# EasyEDA Pro project 轮足机器人主板&核心板.epro, schematic 377核心板原理图
Board Name: 377核心板; Create Date: 2025-02-25; Page Name: 377核心板PCB; Project Name: 轮足机器人主板&核心板; Schematic Name: 377核心板原理图; Update Date: 2025-03-06; Company: 海思路999号412所; Drawed: YienMaster; Page Size: A4; Version: V1.0
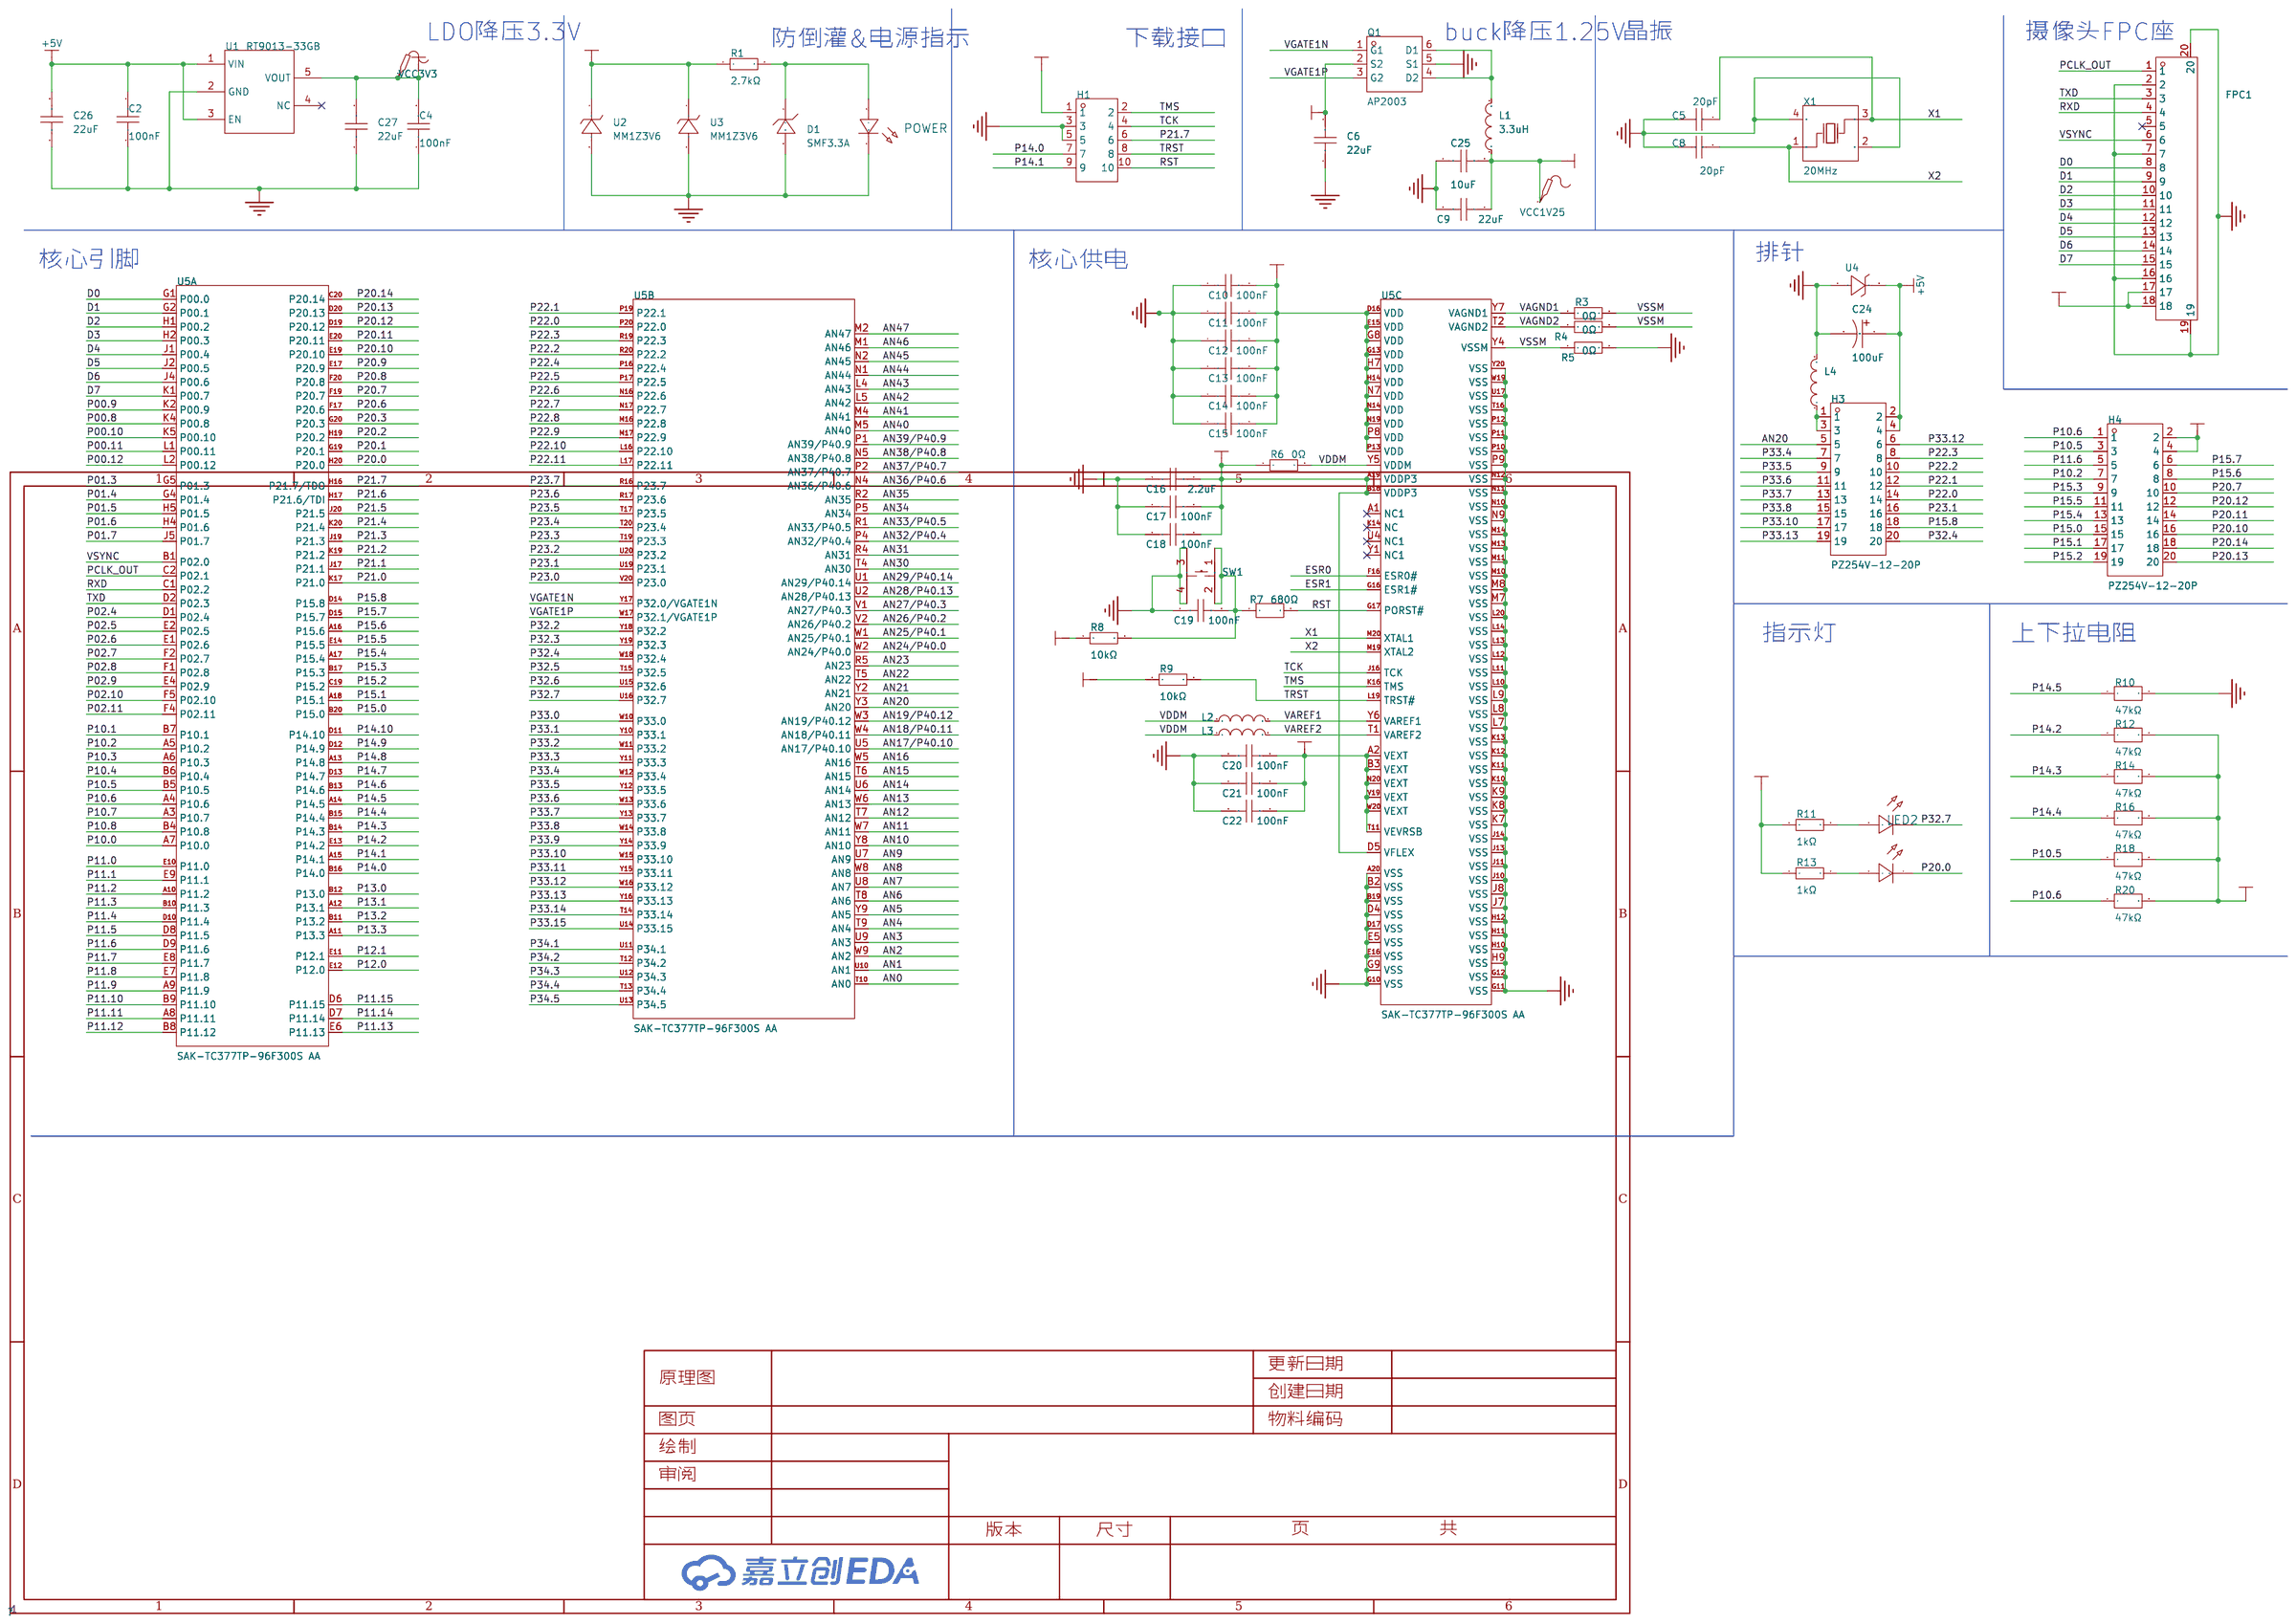
[diagram p5: schematic sheet]

## Parts
C2  100nF  [C0603]
C4  100nF  [C0603]
C5  20pF  [C0603]
C6  22uF  [C0603]
C8  20pF  [C0603]
C9  22uF  [C0603]
C10  100nF  [C0603]
C11  100nF  [C0603]
C12  100nF  [C0603]
C13  100nF  [C0603]
C14  100nF  [C0603]
C15  100nF  [C0603]
C16  2.2uF  [C0603]
C17  100nF  [C0603]
C18  100nF  [C0603]
C19  100nF  [C0603]
C20  100nF  [C0603]
C21  100nF  [C0603]
C22  100nF  [C0603]
C24  100uF  [CAP-SMD_L3.5-W2.8-R-RD]
C25  10uF  [C0603]
C26  22uF  [C0603]
C27  22uF  [C0603]
D1  SMF3.3A  [SOD-123_L2.8-W1.8-LS3.7-RD]
FPC1  FPC-05F-18PH20  [FPC-SMD_18P-P0.50_FPC-05F-18PH20]
H1  PZ254V-12-10P  [HDR-TH_10P-P2.54-V-M-R2-C5-S2.54]
H3  PZ254V-12-20P  [HDR-TH_20P-P2.54-V-M-R2-C10-S2.54]
H4  PZ254V-12-20P  [HDR-TH_20P-P2.54-V-M-R2-C10-S2.54]
L1  3.3uH  [IND-SMD_L4.4-W4.2-A]
L2  CBG160808U000T  [L0603]
L3  CBG160808U000T  [L0603]
L4  CBG201209U000T  [L0805]
LED2  -  [LED_0603]
LED3  -  [LED_0603]
POWER  -  [LED_0603]
Q1  AP2003  [SOT-23-6_L2.9-W1.6-P0.95-LS2.8-BR]
R1  2.7kΩ  [R0603]
R3  0Ω  [R0603]
R4  0Ω  [R0603]
R5  0Ω  [R0603]
R6  0Ω  [R0603]
R7  680Ω  [R0603]
R8  10kΩ  [R0603]
R9  10kΩ  [R0603]
R10  47kΩ  [R0603]
R11  1kΩ  [R0603]
R12  47kΩ  [R0603]
R13  1kΩ  [R0603]
R14  47kΩ  [R0603]
R16  47kΩ  [R0603]
R18  47kΩ  [R0603]
R20  47kΩ  [R0603]
SW1  TS3425BA  [SW-SMD_4P-L4.2-W3.2-P2.15-LS4.6-1]
U1  RT9013-33GB  [SOT-23-5_L3.0-W1.7-P0.95-LS2.8-BL]
U2  MM1Z3V6  [SOD-123_L2.7-W1.6-LS3.7-RD]
U3  MM1Z3V6  [SOD-123_L2.7-W1.6-LS3.7-RD]
U4  MM1Z5V1  [SOD-123_L2.8-W1.8-LS3.9-FD]
U5  SAK-TC377TP-96F300S AA  [PG-LFBGA-292_L17.0-W17.0-BL_SAK-TC1791F]  (sections 1,2,3)
VCC1V25  -  [Test-Point-0.5mm]
VCC3V3  -  [Test-Point-0.5mm]
X1  20MHz  [CRYSTAL-SMD_4P-L3.2-W2.5-BL-2]

## Library data of the parts
C2 C4 = CC0603KRX7R9BB104: 容值:100nF;精度:±10%;额定电压:50V;材质(温度系数):X7R;; LCSC Part Name: 100nF ±10% 50V; Supplier Part: C14663; Manufacturer: YAGEO(国巨); Supplier Footprint: 0603; JLCPCB Part Class: 基础库; Datasheet: https://atta.szlcsc.com/upload/public/pdf/source/20180910/C282072_33301C7F631E79921B82A8DAC6BCC5B3.pdf; Supplier: LCSC; Tolerance: ±10%; Voltage Rated: 50V; Temperature Coefficient: X7R
C5 C8 = CL10C200JB8NNNC: 容值:20pF;精度:±5%;额定电压:50V;材质(温度系数):C0G;; LCSC Part Name: 20pF ±5% 50V; Supplier Part: C1648; Manufacturer: SAMSUNG(三星); Supplier Footprint: 0603; JLCPCB Part Class: 基础库; Datasheet: https://atta.szlcsc.com/upload/public/pdf/source/20160218/1457707763339.pdf; Supplier: LCSC; Tolerance: ±5%; Voltage Rated: 50V; Temperature Coefficient: C0G
C6 C9 C26 C27 = CGA0603X5R226M160JT: 容值:22uF;精度:±20%;额定电压:16V;材质(温度系数):X5R;; LCSC Part Name: 22uF ±20% 16V; Supplier Part: C6119868; Manufacturer: HRE(芯声); Supplier Footprint: 0603; JLCPCB Part Class: 扩展库; Supplier: LCSC; Tolerance: ±20%; Voltage Rated: 16V; Temperature Coefficient: X5R
C10-C15 = CGA0603X7R104K500JT: 容值:100nF;精度:±10%;额定电压:50V;材质(温度系数):X7R;; LCSC Part Name: 100nF ±10% 50V; Supplier Part: C6119867; Manufacturer: HRE(芯声); Supplier Footprint: 0603; JLCPCB Part Class: 扩展库; Supplier: LCSC; Tolerance: ±10%; Voltage Rated: 50V; Temperature Coefficient: X7R
C16 = CL10A225KB8NNNC: 容值:2.2uF;精度:±10%;额定电压:50V;材质(温度系数):X5R;; LCSC Part Name: 2.2uF ±10% 50V; Supplier Part: C913904; Manufacturer: SAMSUNG(三星); Supplier Footprint: 0603; JLCPCB Part Class: 扩展库; Datasheet: https://atta.szlcsc.com/upload/public/pdf/source/20160218/1457707763339.pdf; Supplier: LCSC; Tolerance: ±10%; Voltage Rated: 50V; Temperature Coefficient: X5R
C17-C22 = CAP_0603: Supplier Footprint: 0603
C24 = CA45-B-6.3V-100uF-M: 容值:100uF;精度:±20%;额定电压:6.3V;等效串联电阻:5Ω@100kHz;; LCSC Part Name: 100uF ±20% 6.3V; Supplier Part: C140373; Manufacturer: CEC(振华新云); Supplier Footprint: CASE-B-3528; JLCPCB Part Class: 扩展库; Datasheet: https://atta.szlcsc.com/upload/public/pdf/source/20180125/C140373_15168614962001301521.pdf; Supplier: LCSC; Tolerance: ±20%; Rated Voltage: 6.3V; Equivalent Series Resistance(ESR): 5Ω@100kHz; Operating Temperature: -55℃~+125℃
C25 = CGA0603X5R106K100JT: 容值:10uF;精度:±10%;额定电压:10V;材质(温度系数):X5R;; LCSC Part Name: 10uF ±10% 10V; Supplier Part: C6119842; Manufacturer: HRE(芯声); Supplier Footprint: 0603; JLCPCB Part Class: 扩展库; Supplier: LCSC; Tolerance: ±10%; Voltage Rated: 10V; Temperature Coefficient: X5R
D1 = SMF3.3A_C37331473: 极性:单向;反向截止电压(Vrwm):3.3V;最大钳位电压:7.3V;峰值脉冲电流(Ipp):27.4A;峰值脉冲功率(Ppp):200W;击穿电压:4.3V;; Supplier Part: C37331473; Manufacturer: GOODWORK(固得沃克); Supplier Footprint: SOD-123FL; Datasheet: https://atta.szlcsc.com/upload/public/pdf/source/20240801/D4B373D0611F6B4675800B8155207CFE.pdf; Supplier: LCSC; polarity: 单向; Reverse Stand-Off Voltage (Vrwm): 3.3V; Maximum Clamping Voltage: 7.3V; Peak Pulse Current (Ipp): 27.4A; Peak Pulse Power Dissipation (Ppp): 200W; Breakdown Voltage: 4.3V; Reverse Leakage Current (Ir): 80nA; Number of Lines: 单路; Operating Temperature: -55℃~+150℃@(Tj); Type: TVS
FPC1 = FPC-05F-18PH20: 锁定特性:翻盖式;触点类型:下接;触点数量:18P;间距:0.5mm;安装类型:卧贴;工作温度范围:-25℃~+85℃;; LCSC Part Name: 间距:0.5mm P数:18P 翻盖式 下接; Supplier Part: C2856802; Manufacturer: XUNPU(讯普); Supplier Footprint: SMD,P=0.5mm,卧贴; JLCPCB Part Class: 扩展库; Datasheet: https://atta.szlcsc.com/upload/public/pdf/source/20210922/C2856802_2A845D1961F33AEC1ED22CECB292335F.pdf; Supplier: LCSC; Locking Feature: 翻盖式; Contact Type: 下接; Number of Contacts: 18P; Pitch: 0.5mm; Mounting Type: 卧贴; FFC, FCB Thickness: 0.3mm; Height Above Board: 2mm; Operating Temperature Range: -25℃~+85℃
H1 = PZ254V-12-10P: 插针结构:2x5P;间距:2.54mm;行距:2.54mm;圆针/方针:方针;安装类型:直插;排数:双排;总PIN位数:10P;额定电流:-;额定电压:-;配合针长度:6mm;塑高:2.5mm;端接针长度:3mm;触头材质:黄铜;触头镀层:-;工作温度范围:-40℃~+105℃;颜色:黑色;; LCSC Part Name: 间距:2.54mm 2x5P 直插 方针; Supplier Part: C492422; Manufacturer: XFCN(兴飞); Supplier Footprint: 插件,P=2.54mm; JLCPCB Part Class: 扩展库; Datasheet: https://atta.szlcsc.com/upload/public/pdf/source/20200309/C492422_5020CEA01BE7051F9EA9DD81AB0A25E3.pdf; Supplier: LCSC; Pin Structure: 2x5P; Pitch: 2.54mm; Row Spacing: 2.54mm; Circluar Pins/Square Pins: 方针; Mounting Type: 直插; Number of Rows: 双排; Number of Pins: 10P; Length of Mating Pin: 6mm; Insulation Height: 2.5mm; Length of End Connection Pin: 3mm; Contact Material: 黄铜; Operating Temperature Range: -40℃~+105℃; Color: 黑色
H3 H4 = PZ254V-12-20P: 插针结构:2x10P;间距:2.54mm;行距:2.54mm;圆针/方针:方针;安装类型:直插;排数:双排;总PIN位数:20P;额定电流:-;额定电压:-;配合针长度:6mm;塑高:2.5mm;端接针长度:3mm;触头材质:黄铜;触头镀层:-;工作温度范围:-40℃~+105℃;颜色:黑色;; LCSC Part Name: 间距:2.54mm 2x10P 直插 方针; Supplier Part: C492427; Manufacturer: XFCN(兴飞); Supplier Footprint: 插件,P=2.54mm; JLCPCB Part Class: 扩展库; Datasheet: https://atta.szlcsc.com/upload/public/pdf/source/20200309/C492427_9411E93D35F2EC20CED9A3ED9F4BBE60.pdf; Supplier: LCSC; Pin Structure: 2x10P; Pitch: 2.54mm; Row Spacing: 2.54mm; Circluar Pins/Square Pins: 方针; Mounting Type: 直插; Number of Rows: 双排; Number of Pins: 20P; Length of Mating Pin: 6mm; Insulation Height: 2.5mm; Length of End Connection Pin: 3mm; Contact Material: 黄铜; Operating Temperature Range: -40℃~+105℃; Color: 黑色
L1 = FXL0420-3R3-M: 电感值:3.3uH;精度:±20%;额定电流:3.3A;饱和电流(Isat):4A;类型:一体成型电感;; LCSC Part Name: 3.3uH ±20% 4A; Supplier Part: C167207; Manufacturer: cjiang(长江微电); Supplier Footprint: SMD,4.2x4.4mm; JLCPCB Part Class: 扩展库; Datasheet: https://atta.szlcsc.com/upload/public/pdf/source/20240426/3189EA8206330E2108542F9E34E540E7.pdf; Supplier: LCSC; Tolerance: ±20%; Rated Current: 3.3A; Saturation Current (Isat): 4A; DC Resistance (DCR): 87mΩ; Type: 一体成型电感
L2 L3 = CBG160808U000T: 标称阻抗@测试频率:0Ω@100MHz;直流电阻(RDC):100mΩ;; LCSC Part Name: 单路 0603磁珠 阻抗0Ω@100MHz; Supplier Part: C43163; Manufacturer: FH(风华); Supplier Footprint: 0603; JLCPCB Part Class: 扩展库; Datasheet: https://atta.szlcsc.com/upload/public/pdf/source/20190129/C361667_1614D407CC98D1D3CFBD9E1F7511C14D.pdf; Supplier: LCSC; Impedance @ Frequency: 0Ω@100MHz; DC Resistance: 100mΩ; Current Rating: 800mA; Circuits: 1
L4 = CBG201209U000T: 标称阻抗@测试频率:0Ω@100MHz;直流电阻(RDC):80mΩ;; LCSC Part Name: 单路 0805磁珠 阻抗0Ω@100MHz; Supplier Part: C91037; Manufacturer: FH(风华); Supplier Footprint: 0805; JLCPCB Part Class: 扩展库; Datasheet: https://atta.szlcsc.com/upload/public/pdf/source/20161217/1481939213023.pdf; Supplier: LCSC; Impedance @ Frequency: 0Ω@100MHz; DC Resistance: 80mΩ; Current Rating: 900mA; Circuits: 1
LED2 LED3 POWER = LED_0603-R: Supplier Footprint: 0603
Q1 = AP2003: 类型:1个N沟道+1个P沟道;漏源电压(Vdss):20V;连续漏极电流(Id):3A;导通电阻(RDS(on)@Vgs,Id):75mΩ@4.5V,2.5A;功率(Pd):800mW;阈值电压(Vgs(th)@Id):700mV@250uA;; LCSC Part Name: 1个N沟道+1个P沟道 耐压:20V 电流:3A; Supplier Part: C2849575; Manufacturer: ALLPOWER(铨力); Supplier Footprint: SOT-23-6; JLCPCB Part Class: 扩展库; Datasheet: https://atta.szlcsc.com/upload/public/pdf/source/20210723/C2849575_D5662A091ADF76BB7231C05490DE9B38.pdf; Supplier: LCSC; Type: 1个N沟道+1个P沟道; Drain Source Voltage (Vdss): 20V; Continuous Drain Current (Id): 3A; Drain Source On Resistance (RDS(on)@Vgs,Id): 75mΩ@4.5V,2.5A; Power Dissipation (Pd): 800mW; Gate Threshold Voltage (Vgs(th)@Id): 700mV@250uA; Total Gate Charge (Qg@Vgs): 3.2nC; Input Capacitance (Ciss@Vds): 325pF@10V; Reverse Transfer Capacitance (Crss@Vds): 37pF@10V; Operating Temperature: -55℃~+150℃
R1 = 0603WAF2701T5E: 电阻类型:厚膜电阻;阻值:2.7kΩ;精度:±1%;功率:100mW;最大工作电压:75V;温度系数:±100ppm/℃;; LCSC Part Name: 2.7kΩ ±1% 100mW 厚膜电阻; Supplier Part: C13167; Manufacturer: UNI-ROYAL(厚声); Supplier Footprint: 0603; JLCPCB Part Class: 基础库; Datasheet: https://atta.szlcsc.com/upload/public/pdf/source/20200306/C422600_1E6D84923E4A46A82E41ADD87F860B5C.pdf; Supplier: LCSC; Type: 厚膜电阻; Tolerance: ±1%; Power(Watts): 100mW; Overload Voltage (Max): 75V; Temperature Coefficient: ±100ppm/℃; Operating Temperature Range: -55℃~+155℃
R3-R6 = 0603WAF0000T5E: 电阻类型:厚膜电阻;阻值:0Ω;精度:±1%;功率:100mW;最大工作电压:75V;; LCSC Part Name: 0Ω ±1% 100mW 厚膜电阻; Supplier Part: C21189; Manufacturer: UNI-ROYAL(厚声); Supplier Footprint: 0603; JLCPCB Part Class: 基础库; Datasheet: https://atta.szlcsc.com/upload/public/pdf/source/20200306/C422600_1E6D84923E4A46A82E41ADD87F860B5C.pdf; Supplier: LCSC; Type: 厚膜电阻; Tolerance: ±1%; Power(Watts): 100mW; Overload Voltage (Max): 75V; Operating Temperature Range: -55℃~+155℃
R7 = FRC0603F6800TS: 电阻类型:厚膜电阻;阻值:680Ω;精度:±1%;功率:100mW;最大工作电压:75V;温度系数:±100ppm/℃;; LCSC Part Name: 680Ω ±1% 100mW 厚膜电阻; Supplier Part: C2907062; Manufacturer: FOJAN(富捷); Supplier Footprint: 0603; JLCPCB Part Class: 扩展库; Datasheet: https://atta.szlcsc.com/upload/public/pdf/source/20211221/925EC7D7225764EE0046F22065062C87.pdf; Supplier: LCSC; Type: 厚膜电阻; Tolerance: ±1%; Power(Watts): 100mW; Overload Voltage (Max): 75V; Temperature Coefficient: ±100ppm/℃; Operating Temperature Range: -55℃~+155℃
R8 R9 = 0603WAF1002T5E: 电阻类型:厚膜电阻;阻值:10kΩ;精度:±1%;功率:100mW;最大工作电压:75V;温度系数:±100ppm/℃;; LCSC Part Name: 厚膜电阻 10kΩ ±1% 100mW; Supplier Part: C25804; Manufacturer: UNI-ROYAL(厚声); Supplier Footprint: 0603; JLCPCB Part Class: 基础库; Datasheet: https://atta.szlcsc.com/upload/public/pdf/source/20200306/C422600_1E6D84923E4A46A82E41ADD87F860B5C.pdf; Supplier: LCSC; Type: 厚膜电阻; Tolerance: ±1%; Power(Watts): 100mW; Overload Voltage (Max): 75V; Temperature Coefficient: ±100ppm/℃; Operating Temperature Range: -55℃~+155℃
R10 R12 R14 R16 R18 R20 = FRC0603F4702TS: 电阻类型:厚膜电阻;阻值:47kΩ;精度:±1%;功率:100mW;最大工作电压:75V;温度系数:±100ppm/℃;; LCSC Part Name: 47kΩ ±1% 100mW 厚膜电阻; Supplier Part: C2907042; Manufacturer: FOJAN(富捷); Supplier Footprint: 0603; JLCPCB Part Class: 扩展库; Datasheet: https://atta.szlcsc.com/upload/public/pdf/source/20211221/925EC7D7225764EE0046F22065062C87.pdf; Supplier: LCSC; Type: 厚膜电阻; Tolerance: ±1%; Power(Watts): 100mW; Overload Voltage (Max): 75V; Temperature Coefficient: ±100ppm/℃; Operating Temperature Range: -55℃~+155℃
R11 R13 = 0603WAF1001T5E: 电阻类型:厚膜电阻;阻值:1kΩ;精度:±1%;功率:100mW;最大工作电压:75V;温度系数:±100ppm/℃;; LCSC Part Name: 1kΩ ±1% 100mW 厚膜电阻; Supplier Part: C21190; Manufacturer: UNI-ROYAL(厚声); Supplier Footprint: 0603; JLCPCB Part Class: 基础库; Datasheet: https://atta.szlcsc.com/upload/public/pdf/source/20200306/C422600_1E6D84923E4A46A82E41ADD87F860B5C.pdf; Supplier: LCSC; Type: 厚膜电阻; Tolerance: ±1%; Power(Watts): 100mW; Overload Voltage (Max): 75V; Temperature Coefficient: ±100ppm/℃; Operating Temperature Range: -55℃~+155℃
SW1 = TS3425BA: 电路结构:单刀单掷;按钮形状:椭圆形按钮;作用力:250gf;安装方式:立贴;开关长度:4.2mm;开关宽度:3.2mm;开关高度:2.5mm;带支架:不带;触点电流:50mA;额定电压(DC):12V;绝缘电阻:100MΩ;机械寿命:10万次;; LCSC Part Name: 4.2*3.2*2.5mm 立贴 轻触开关; Supplier Part: C2681476; Manufacturer: SHOU HAN(首韩); Supplier Footprint: SMD; JLCPCB Part Class: 扩展库; Datasheet: https://atta.szlcsc.com/upload/public/pdf/source/20210107/C2681476_BF217B2301F0070AA49504CB0BFDE895.pdf; Supplier: LCSC; Circuit: 单刀单掷; Actuator Style: 椭圆形按钮; Operating Force: 250gf; Mounting Style: 立贴; Switch Length: 4.2mm; Switch Width: 3.2mm; Switch Height: 2.5mm; Strike Gundam: 不带; Contact Current: 50mA; Voltage Rating (DC): 12V; Insulation Resistance: 100MΩ; Actuator/Cap Color: 白色; Pin Style: J型引脚; Mechanical Life: 10万次; Operating Temperature: -20℃~+85℃
U1 = RT9013-33GB: 输出类型:固定;最大输入电压:5.5V;输出电压:3.3V;最大输出电流:500mA;电源纹波抑制比(PSRR):50dB@(10kHz);输出极性:正极;; LCSC Part Name: 输入5.5V 输出3.3V 500mA; Supplier Part: C47773; Manufacturer: RICHTEK(立锜); Supplier Footprint: SOT-23-5; JLCPCB Part Class: 扩展库; Datasheet: https://atta.szlcsc.com/upload/public/pdf/source/20150504/1457707282459.pdf; Supplier: LCSC; Output Type: 固定; Maximum Input Voltage: 5.5V; Output Voltage: 3.3V; MAX Output Current: 500mA; Power Supply Rejection Ratio (PSRR): 50dB@(10kHz); Dropout Voltage: 400mV@(500mA); standby current: 50uA; Operating Temperature: -40℃~+85℃; Output Polarity: 正极; Number of Outputs: 1
U2 U3 = MM1Z3V6_C22379457: 二极管配置:独立式;稳压值(标称值):3.6V;稳压值(范围):3.4V~3.8V;功率(Pd):500mW;; Supplier Part: C22379457; Manufacturer: 宏迦橙; Supplier Footprint: SOD-123; JLCPCB Part Class: 扩展库; Datasheet: https://atta.szlcsc.com/upload/public/pdf/source/20240409/F951BD59469D21DC5C1B102046132536.pdf; Supplier: LCSC; Diode Configuration: 独立式; Zener Voltage (Nom): 3.6V; Reverse Leakage Current (Ir): 10uA@1V; Zener Voltage (Range): 3.4V~3.8V; Power Dissipation: 500mW; Zener Impedance (Zzt): 130Ω
U4 = MM1Z5V1_C22395538: 二极管配置:独立式;稳压值(标称值):5.1V;稳压值(范围):4.8V~5.4V;功率(Pd):500mW;; Supplier Part: C22395538; Manufacturer: 宏迦橙; Supplier Footprint: SOD-123; JLCPCB Part Class: 扩展库; Datasheet: https://atta.szlcsc.com/upload/public/pdf/source/20240509/BF8DF6535F590805FC631EC33072162A.pdf; Supplier: LCSC; Diode Configuration: 独立式; Zener Voltage (Nom): 5.1V; Reverse Leakage Current (Ir): 2uA@1.5V; Zener Voltage (Range): 4.8V~5.4V; Power Dissipation: 500mW; Zener Impedance (Zzt): 130Ω
U5 = SAK-TC377TP-96F300S AA: Supplier Part: C538866; Manufacturer: Infineon(英飞凌); Supplier Footprint: LFBGA-292; JLCPCB Part Class: 扩展库; Datasheet: https://atta.szlcsc.com/upload/public/pdf/source/20230201/4817F3AB8052933065390DBFE5F4B895.pdf; Supplier: LCSC
VCC1V25 VCC3V3 = Test-Point: Test Point 测试点
X1 = X322520MSB4SI: 晶振类型:贴片晶振;频率:20MHz;常温频差:±10ppm;负载电容:20pF;频率稳定度:±20ppm;; LCSC Part Name: 20MHz ±10ppm 20pF; Supplier Part: C9004; Manufacturer: YXC(扬兴晶振); Supplier Footprint: SMD3225-4P; JLCPCB Part Class: Extended Part; Datasheet: https://atta.szlcsc.com/upload/public/pdf/source/20240329/19D5F850207469550BEB00D7DFEDBC7A.pdf; Supplier: LCSC; Type: 贴片晶振; Normal temperature Frequency Tolerance: ±10ppm; Load Capacitance: 20pF; Frequency Stability: ±20ppm; Operating Temperature: -40℃~+85℃

## Nets
+5V: C2.2 C24.1 C26.2 H3.2 H3.4 U1.1(VIN) U1.3(EN) U4.2(K)
GND: C2.1 C4.1 C5.1 C6.1 C8.1 C9.2 C10.1 C11.1 C12.1 C13.1 C14.1 C15.1 C16.1 C17.1 C18.1 C19.1 C20.1 C21.1 C22.1 C24.2 C25.1 C26.1 C27.1 D1.2 FPC1.2 FPC1.7 FPC1.16 FPC1.19 FPC1.20 H1.3 H1.5 L4.2 POWER.1(C) Q1.5(S1) R5.2 R10.2 SW1.3 SW1.4 U1.2(GND) U2.2(A) U3.2(A) U4.1(A) U5.A20(VSS) U5.B2(VSS) U5.B19(VSS) U5.D4(VSS) U5.D17(VSS) U5.E5(VSS) U5.E16(VSS) U5.G9(VSS) U5.G10(VSS) U5.G11(VSS) U5.G12(VSS) U5.H9(VSS) U5.H10(VSS) U5.H11(VSS) U5.H12(VSS) U5.J7(VSS) U5.J8(VSS) U5.J10(VSS) U5.J11(VSS) U5.J13(VSS) U5.J14(VSS) U5.K7(VSS) U5.K8(VSS) U5.K9(VSS) U5.K10(VSS) U5.K11(VSS) U5.K12(VSS) U5.K13(VSS) U5.L7(VSS) U5.L8(VSS) U5.L9(VSS) U5.L10(VSS) U5.L11(VSS) U5.L12(VSS) U5.L13(VSS) U5.L14(VSS) U5.L20(VSS) U5.M7(VSS) U5.M8(VSS) U5.M10(VSS) U5.M11(VSS) U5.M13(VSS) U5.M14(VSS) U5.N9(VSS) U5.N10(VSS) U5.N11(VSS) U5.N12(VSS) U5.P9(VSS) U5.P10(VSS) U5.P11(VSS) U5.P12(VSS) U5.T16(VSS) U5.U17(VSS) U5.W19(VSS) U5.Y20(VSS) X1.2(GND) X1.4(GND)
VCC1V25: C9.1 C10.2 C11.2 C12.2 C13.2 C14.2 C15.2 C25.2 L1.1 U5.D16(VDD) U5.E15(VDD) U5.G8(VDD) U5.G13(VDD) U5.H7(VDD) U5.H14(VDD) U5.N7(VDD) U5.N14(VDD) U5.N19(VDD) U5.P8(VDD) U5.P13(VDD) VCC1V25.1
VCC3V3: C4.2 C6.2 C16.2 C17.2 C18.2 C20.2 C21.2 C22.2 C27.2 H1.1 Q1.2(S2) R1.1 R6.1 R8.1 R9.1 R11.1 R12.2 R13.1 R14.2 R16.2 R18.2 R20.2 U1.5(VOUT) U2.1(K) U3.1(K) U5.A2(VEXT) U5.A19(VDDP3) U5.B3(VEXT) U5.B18(VDDP3) U5.D5(VFLEX) U5.N20(VEXT) U5.T11(VEVRSB) U5.V19(VEXT) U5.W20(VEXT) VCC3V3.1
VCCCAM: FPC1.17 FPC1.18 H4.2 H4.4
VDDM: L2.1 L3.1 R6.2 U5.Y5(VDDM)
VSSM: R3.2 R4.2 R5.1 U5.Y4(VSSM)
AN0: U5.T10(AN0)
AN1: U5.U10(AN1)
AN2: U5.W9(AN2)
AN3: U5.U9(AN3)
AN4: U5.T9(AN4)
AN5: U5.Y9(AN5)
AN6: U5.T8(AN6)
AN7: U5.U8(AN7)
AN8: U5.W8(AN8)
AN9: U5.U7(AN9)
AN10: U5.Y8(AN10)
AN11: U5.W7(AN11)
AN12: U5.T7(AN12)
AN13: U5.W6(AN13)
AN14: U5.U6(AN14)
AN15: U5.T6(AN15)
AN16: U5.W5(AN16)
AN17/P40.10: U5.U5(AN17/P40.10)
AN18/P40.11: U5.W4(AN18/P40.11)
AN19/P40.12: U5.W3(AN19/P40.12)
AN20: H3.5 U5.Y3(AN20)
AN21: U5.Y2(AN21)
AN22: U5.T5(AN22)
AN23: U5.R5(AN23)
AN24/P40.0: U5.W2(AN24/P40.0)
AN25/P40.1: U5.W1(AN25/P40.1)
AN26/P40.2: U5.V2(AN26/P40.2)
AN27/P40.3: U5.V1(AN27/P40.3)
AN28/P40.13: U5.U2(AN28/P40.13)
AN29/P40.14: U5.U1(AN29/P40.14)
AN30: U5.T4(AN30)
AN31: U5.R4(AN31)
AN32/P40.4: U5.P4(AN32/P40.4)
AN33/P40.5: U5.R1(AN33/P40.5)
AN34: U5.P5(AN34)
AN35: U5.R2(AN35)
AN36/P40.6: U5.N4(AN36/P40.6)
AN37/P40.7: U5.P2(AN37/P40.7)
AN38/P40.8: U5.N5(AN38/P40.8)
AN39/P40.9: U5.P1(AN39/P40.9)
AN40: U5.M5(AN40)
AN41: U5.M4(AN41)
AN42: U5.L5(AN42)
AN43: U5.L4(AN43)
AN44: U5.N1(AN44)
AN45: U5.N2(AN45)
AN46: U5.M1(AN46)
AN47: U5.M2(AN47)
D0: FPC1.8 U5.G1(P00.0)
D1: FPC1.9 U5.G2(P00.1)
D2: FPC1.10 U5.H1(P00.2)
D3: FPC1.11 U5.H2(P00.3)
D4: FPC1.12 U5.J1(P00.4)
D5: FPC1.13 U5.J2(P00.5)
D6: FPC1.14 U5.J4(P00.6)
D7: FPC1.15 U5.K1(P00.7)
ESR0: U5.F16(ESR0#)
ESR1: U5.G16(ESR1#)
P00.8: U5.K4(P00.8)
P00.9: U5.K2(P00.9)
P00.10: U5.K5(P00.10)
P00.11: U5.L1(P00.11)
P00.12: U5.L2(P00.12)
P01.3: U5.G5(P01.3)
P01.4: U5.G4(P01.4)
P01.5: U5.H5(P01.5)
P01.6: U5.H4(P01.6)
P01.7: U5.J5(P01.7)
P02.4: U5.D1(P02.4)
P02.5: U5.E2(P02.5)
P02.6: U5.E1(P02.6)
P02.7: U5.F2(P02.7)
P02.8: U5.F1(P02.8)
P02.9: U5.E4(P02.9)
P02.10: U5.F5(P02.10)
P02.11: U5.F4(P02.11)
P10.0: U5.A7(P10.0)
P10.1: U5.B7(P10.1)
P10.2: H4.7 U5.A5(P10.2)
P10.3: U5.A6(P10.3)
P10.4: U5.B6(P10.4)
P10.5: H4.3 R18.1 U5.B5(P10.5)
P10.6: H4.1 R20.1 U5.A4(P10.6)
P10.7: U5.A3(P10.7)
P10.8: U5.B4(P10.8)
P11.0: U5.E10(P11.0)
P11.1: U5.E9(P11.1)
P11.2: U5.A10(P11.2)
P11.3: U5.B10(P11.3)
P11.4: U5.D10(P11.4)
P11.5: U5.D8(P11.5)
P11.6: H4.5 U5.D9(P11.6)
P11.7: U5.E8(P11.7)
P11.8: U5.E7(P11.8)
P11.9: U5.A9(P11.9)
P11.10: U5.B9(P11.10)
P11.11: U5.A8(P11.11)
P11.12: U5.B8(P11.12)
P11.13: U5.E6(P11.13)
P11.14: U5.D7(P11.14)
P11.15: U5.D6(P11.15)
P12.0: U5.E12(P12.0)
P12.1: U5.E11(P12.1)
P13.0: U5.B12(P13.0)
P13.1: U5.A12(P13.1)
P13.2: U5.B11(P13.2)
P13.3: U5.A11(P13.3)
P14.0: H1.7 U5.B16(P14.0)
P14.1: H1.9 U5.A15(P14.1)
P14.2: R12.1 U5.E13(P14.2)
P14.3: R14.1 U5.B14(P14.3)
P14.4: R16.1 U5.B15(P14.4)
P14.5: R10.1 U5.A14(P14.5)
P14.6: U5.B13(P14.6)
P14.7: U5.D13(P14.7)
P14.8: U5.A13(P14.8)
P14.9: U5.D12(P14.9)
P14.10: U5.D11(P14.10)
P15.0: H4.15 U5.B20(P15.0)
P15.1: H4.17 U5.A18(P15.1)
P15.2: H4.19 U5.C19(P15.2)
P15.3: H4.9 U5.B17(P15.3)
P15.4: H4.13 U5.A17(P15.4)
P15.5: H4.11 U5.E14(P15.5)
P15.6: H4.8 U5.A16(P15.6)
P15.7: H4.6 U5.D15(P15.7)
P15.8: H3.18 U5.D14(P15.8)
P20.0: LED3.1(C) U5.H20(P20.0)
P20.1: U5.G19(P20.1)
P20.2: U5.H19(P20.2)
P20.3: U5.G20(P20.3)
P20.6: U5.F17(P20.6)
P20.7: H4.10 U5.F19(P20.7)
P20.8: U5.F20(P20.8)
P20.9: U5.E17(P20.9)
P20.10: H4.16 U5.E19(P20.10)
P20.11: H4.14 U5.E20(P20.11)
P20.12: H4.12 U5.D19(P20.12)
P20.13: H4.20 U5.D20(P20.13)
P20.14: H4.18 U5.C20(P20.14)
P21.0: U5.K17(P21.0)
P21.1: U5.J17(P21.1)
P21.2: U5.K19(P21.2)
P21.3: U5.J19(P21.3)
P21.4: U5.K20(P21.4)
P21.5: U5.J20(P21.5)
P21.6: U5.H17(P21.6/TDI)
P21.7: H1.6 U5.H16(P21.7/TDO)
P22.0: H3.14 U5.P20(P22.0)
P22.1: H3.12 U5.P19(P22.1)
P22.2: H3.10 U5.R20(P22.2)
P22.3: H3.8 U5.R19(P22.3)
P22.4: U5.P16(P22.4)
P22.5: U5.P17(P22.5)
P22.6: U5.N16(P22.6)
P22.7: U5.N17(P22.7)
P22.8: U5.M16(P22.8)
P22.9: U5.M17(P22.9)
P22.10: U5.L16(P22.10)
P22.11: U5.L17(P22.11)
P23.0: U5.V20(P23.0)
P23.1: H3.16 U5.U19(P23.1)
P23.2: U5.U20(P23.2)
P23.3: U5.T19(P23.3)
P23.4: U5.T20(P23.4)
P23.5: U5.T17(P23.5)
P23.6: U5.R17(P23.6)
P23.7: U5.R16(P23.7)
P32.2: U5.Y18(P32.2)
P32.3: U5.Y19(P32.3)
P32.4: H3.20 U5.W18(P32.4)
P32.5: U5.T15(P32.5)
P32.6: U5.U15(P32.6)
P32.7: LED2.1(C) U5.U16(P32.7)
P33.0: U5.W10(P33.0)
P33.1: U5.Y10(P33.1)
P33.2: U5.W11(P33.2)
P33.3: U5.Y11(P33.3)
P33.4: H3.7 U5.W12(P33.4)
P33.5: H3.9 U5.Y12(P33.5)
P33.6: H3.11 U5.W13(P33.6)
P33.7: H3.13 U5.Y13(P33.7)
P33.8: H3.15 U5.W14(P33.8)
P33.9: U5.Y14(P33.9)
P33.10: H3.17 U5.W15(P33.10)
P33.11: U5.Y15(P33.11)
P33.12: H3.6 U5.W16(P33.12)
P33.13: H3.19 U5.Y16(P33.13)
P33.14: U5.T14(P33.14)
P33.15: U5.U14(P33.15)
P34.1: U5.U11(P34.1)
P34.2: U5.T12(P34.2)
P34.3: U5.U12(P34.3)
P34.4: U5.T13(P34.4)
P34.5: U5.U13(P34.5)
PCLK_OUT: FPC1.1 U5.C2(P02.1)
RST: H1.10 R7.2 U5.G17(PORST#)
RXD: FPC1.4 U5.C1(P02.2)
TCK: H1.4 U5.J16(TCK)
TMS: H1.2 U5.K16(TMS)
TRST: H1.8 R9.2 U5.L19(TRST#)
TXD: FPC1.3 U5.D2(P02.3)
VAGND1: R3.1 U5.Y7(VAGND1)
VAGND2: R4.1 U5.T2(VAGND2)
VAREF1: L2.2 U5.Y6(VAREF1)
VAREF2: L3.2 U5.T1(VAREF2)
VGATE1N: Q1.1(G1) U5.Y17(P32.0/VGATE1N)
VGATE1P: Q1.3(G2) U5.W17(P32.1/VGATE1P)
VSYNC: FPC1.6 U5.B1(P02.0)
X1: C5.2 U5.M20(XTAL1) X1.3(OSC2)
X2: C8.2 U5.M19(XTAL2) X1.1(OSC1)
$1N8080: C19.2 R7.1 R8.2 SW1.1 SW1.2
$1N10446: D1.1 POWER.2(A) R1.2
$1N13159: LED2.2(A) R11.2
$1N13163: LED3.2(A) R13.2
$1N14426: L1.2 Q1.4(D2) Q1.6(D1)
$1N27311: H3.1 H3.3 L4.1

Not connected (* = marked no-connect by the designer): FPC1 5*; U1 4(NC)*; U5 A1(NC1)* K14(NC)* U4(NC1)* Y1(NC1)*

## Notes on the sheet
- LDO降压3.3V
- buck降压1.25V
- 晶振
- 摄像头FPC座
- 防倒灌&电源指示
- 下载接口
- 核心引脚
- 核心供电
- 排针
- 指示灯
- 上下拉电阻
